# EAGLE design ISP_LPC9xx_USB_RE_v1.1_mini (EAGLE 5.11)
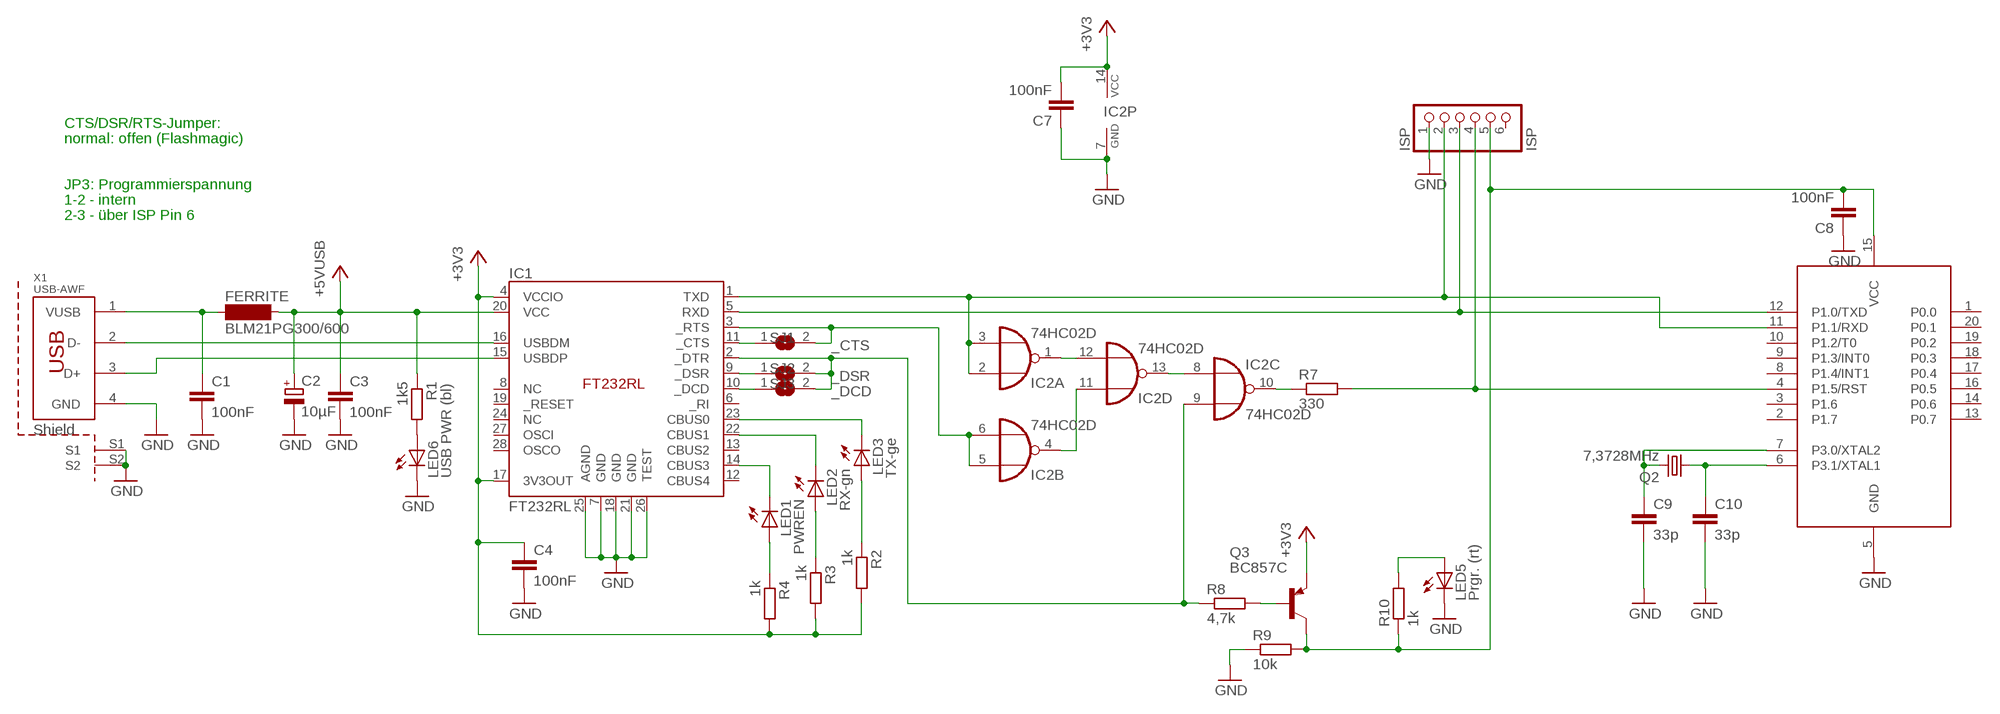
[diagram p0: schematic, sheet 1]

## Parts
C1  100nF  C-EUC0805K  [C0805K]
C2  10µF  CPOL-EU153CLV-0405  [153CLV-0405]
C3  100nF  C-EUC0805K  [C0805K]
C4  100nF  C-EUC0805K  [C0805K]
C7  100nF  C-EUC0805K  [C0805K]
C8  100nF  C-EUC0805K  [C0805K]
C9  33p  C-EUC0805K  [C0805K]
C10  33p  C-EUC0805K  [C0805K]
FERRITE  BLM21PG300/600  SM-1206  [SM-1206]
IC1  FT232RL  [SSOP-28]
IC2  74HC02D  [SO14]
ISP  ISP  PINHD-1X6  [1X06]
LED1  PWREN  LEDCHIP-LED0805  [CHIP-LED0805]
LED2  RX-gn  LEDCHIP-LED0805  [CHIP-LED0805]
LED3  TX-ge  LEDCHIP-LED0805  [CHIP-LED0805]
LED5  Prgr. (rt)  LEDCHIP-LED0805  [CHIP-LED0805]
LED6  USB PWR (bl)  LEDCHIP-LED0805  [CHIP-LED0805]
Q2  7,3728MHz  CRYSTALHC49S  [HC49/S]
Q3  BC857C  BC857C-PNP-SOT23-BEC  [SOT23-BEC]
R1  1k5  R-EU_M1206  [M1206]
R2  1k  R-EU_M1206  [M1206]
R3  1k  R-EU_M1206  [M1206]
R4  1k  R-EU_M1206  [M1206]
R7  330  R-EU_M1206  [M1206]
R8  4,7k  R-EU_M1206  [M1206]
R9  10k  R-EU_M1206  [M1206]
R10  1k  R-EU_M1206  [M1206]
SJ1  _CTS  SJ  [SJ]
SJ2  _DSR  SJ  [SJ]
SJ3  _DCD  SJ  [SJ]
U2  89LPC922  [DIL20]
X1  USB-AWF  USB-1X-2S-PLUG-A-THT  [USB-PLUG-A-THT-2S]

## Nets
+3V3: C4.1 C7.2 IC1.4(VCCIO) IC1.17(3V3OUT) IC2.14(P:VCC) Q3.E R2.2 R3.2 R4.2
+5V: C2.+ C3.1 FERRITE.2 IC1.20(VCC) R1.1 ; supply symbol labelled +5VUSB
DSR_DCD_DTR: IC1.2(_DTR) IC2.9(C:I1) R8.1 SJ2.2 SJ3.2
GND: C1.2 C2.- C3.2 C4.2 C7.1 C8.1 C9.2 C10.2 IC1.7(GND) IC1.18(GND) IC1.21(GND) IC1.25(AGND) IC1.26(TEST) IC2.7(P:GND) ISP.1 LED5.C LED6.C R9.1 U2.5(GND) X1.4(GND) X1.S1 X1.S2
N$1: IC1.5(RXD) ISP.3 U2.12(P1.0/TXD)
N$2: C9.1 Q2.2 U2.7(P3.0/XTAL2)
N$3: IC2.4(B:O) IC2.11(D:I0)
N$5: ISP.4 R7.2 U2.4(P1.5/RST)
N$6: C8.2 ISP.5 Q3.C R9.2 R10.1 U2.15(VCC)
N$8: IC1.1(TXD) IC2.2(A:I0) IC2.3(A:I1) ISP.2 U2.11(P1.1/RXD)
N$9: LED6.A R1.2
N$10: IC2.1(A:O) IC2.12(D:I1)
N$11: C10.1 Q2.1 U2.6(P3.1/XTAL1)
N$13: LED5.A R10.2
N$14: IC1.16(USBDM) X1.2(D-)
N$15: IC2.8(C:I0) IC2.13(D:O)
N$17: IC1.15(USBDP) X1.3(D+)
N$19: Q3.B R8.2
N$20: IC1.11(_CTS) SJ1.1
N$21: IC1.9(_DSR) SJ2.1
N$22: IC1.10(_DCD) SJ3.1
N$23: LED2.A R3.1
N$24: LED3.A R2.1
N$25: IC1.22(CBUS1) LED2.C
N$26: IC1.23(CBUS0) LED3.C
N$28: IC2.10(C:O) R7.1
N$29: IC1.14(CBUS3) LED1.C
N$30: LED1.A R4.1
N$47: C1.1 FERRITE.1 X1.1(VUSB)
RTS_CTS1: IC1.3(_RTS) IC2.5(B:I0) IC2.6(B:I1) SJ1.2
Unconnected: IC1.6(_RI) IC1.8(NC) IC1.12(CBUS4) IC1.13(CBUS2) IC1.19(_RESET) IC1.24(NC) IC1.27(OSCI) IC1.28(OSCO) ISP.6 U2.1(P0.0) U2.2(P1.7) U2.3(P1.6) U2.8(P1.4/INT1) U2.9(P1.3/INT0) U2.10(P1.2/T0) U2.13(P0.7) U2.14(P0.6) U2.16(P0.5) U2.17(P0.4) U2.18(P0.3) U2.19(P0.2) U2.20(P0.1)

## Notes on the sheet
- CTS/DSR/RTS-Jumper:
- normal: offen (Flashmagic)
- JP3: Programmierspannung
- 1-2 - intern
- 2-3 - über ISP Pin 6

## Library data of the parts
C1 C3 C4 C7-C10 = rcl:C-EU: CAPACITOR, European symbol
C2 = rcl:CPOL-EU: POLARIZED CAPACITOR, European symbol
FERRITE = inductor-neosid:SM-1206: INDUCTOR SMD chip inductor
IC1 = ftdi4:FT232RL
IC2 = 74xx-eu:74*02: Quad 2-input NOR gate
ISP = pinhead:PINHD-1X6: PIN HEADER
LED1-LED3 LED5 LED6 = led:LED: LED OSRAM: - CHIPLED LG R971, LG N971, LY N971, LG Q971, LY Q971, LO R971, LY R971 LH N974, LH R974 LS Q976, LO Q976, LY Q976 LO Q996 - Hyper CHIPLED LW Q18S LB Q993, LB Q99A, LB R99A - SideLED LS A670, LO A670, LY A670, LG A670, LP A670 LB A673, LV A673, LT A673, LW A673 LH A674 LY A675 LS A676, LA A676, LO A676, LY A676, LW A676 LS A679, LY A679, LG A679 - Hyper Micro SIDELED® LS Y876, LA Y876, LO Y876, LY Y876 LT Y87S - SmartLED LW L88C, LW L88S LB L89C, LB L89S, LG L890 LS L89K, LO L89K, LY L89K LS L896, LA L896, LO L896, LY L896 - TOPLED LS T670, LO T670, LY T670, LG T670, LP T670 LSG T670, LSP T670, LSY T670, LOP T670, LYG T670 LG T671, LOG T671, LSG T671 LB T673, LV T673, LT T673, LW T673 LH T674 LS T676, LA T676, LO T676, LY T676, LB T676, LH T676, LSB T676, LW T676 LB T67C, LV T67C, LT T67C, LS T67K, LO T67K, LY T67K, LW E67C LS E67B, LA E67B, LO E67B, LY E67B, LB E67C, LV E67C, LT E67C LW T67C LS T679, LY T679, LG T679 LS T770, LO T770, LY T770, LG T770, LP T770 LB T773, LV T773, LT T773, LW T773 LH T774 LS E675, LA E675, LY E675, LS T675 LS T776, LA T776, LO T776, LY T776, LB T776 LHGB T686 LT T68C, LB T68C - Hyper Mini TOPLED® LB M676 - Mini TOPLED Santana® LG M470 LS M47K, LO M47K, LY M47K Source: http://www.osram.convergy.de LUXEON: - LUMILED® LXK2-PW12-R00, LXK2-PW12-S00, LXK2-PW14-U00, LXK2-PW14-V00 LXK2-PM12-R00, LXK2-PM12-S00, LXK2-PM14-U00 LXK2-PE12-Q00, LXK2-PE12-R00, LXK2-PE12-S00, LXK2-PE14-T00, LXK2-PE14-U00 LXK2-PB12-K00, LXK2-PB12-L00, LXK2-PB12-M00, LXK2-PB14-N00, LXK2-PB14-P00, LXK2-PB14-Q00 LXK2-PR12-L00, LXK2-PR12-M00, LXK2-PR14-Q00, LXK2-PR14-R00 LXK2-PD12-Q00, LXK2-PD12-R00, LXK2-PD12-S00 LXK2-PH12-R00, LXK2-PH12-S00 LXK2-PL12-P00, LXK2-PL12-Q00, LXK2-PL12-R00 Source: www.luxeon.com KINGBRIGHT: KA-3528ASYC Source: www.kingbright.com
Q2 = crystal:CRYSTAL: CRYSTAL
Q3 = transistor:*-PNP-: PNP Transistror
R1-R4 R7-R10 = resistor:R-EU_: RESISTOR, European symbol
SJ1-SJ3 = jumper:SJ: SMD solder JUMPER
U2 = micro-philips:89LPC922
X1 = _con-usb_1:USB-1X-2S: USB A/M USB Typ A / USB Typ B Ausführung SMD/THT/DIP, Side-Entry, Ultraflach 2x Shield Reichelt USB-AGF, USB-AWF

## Board
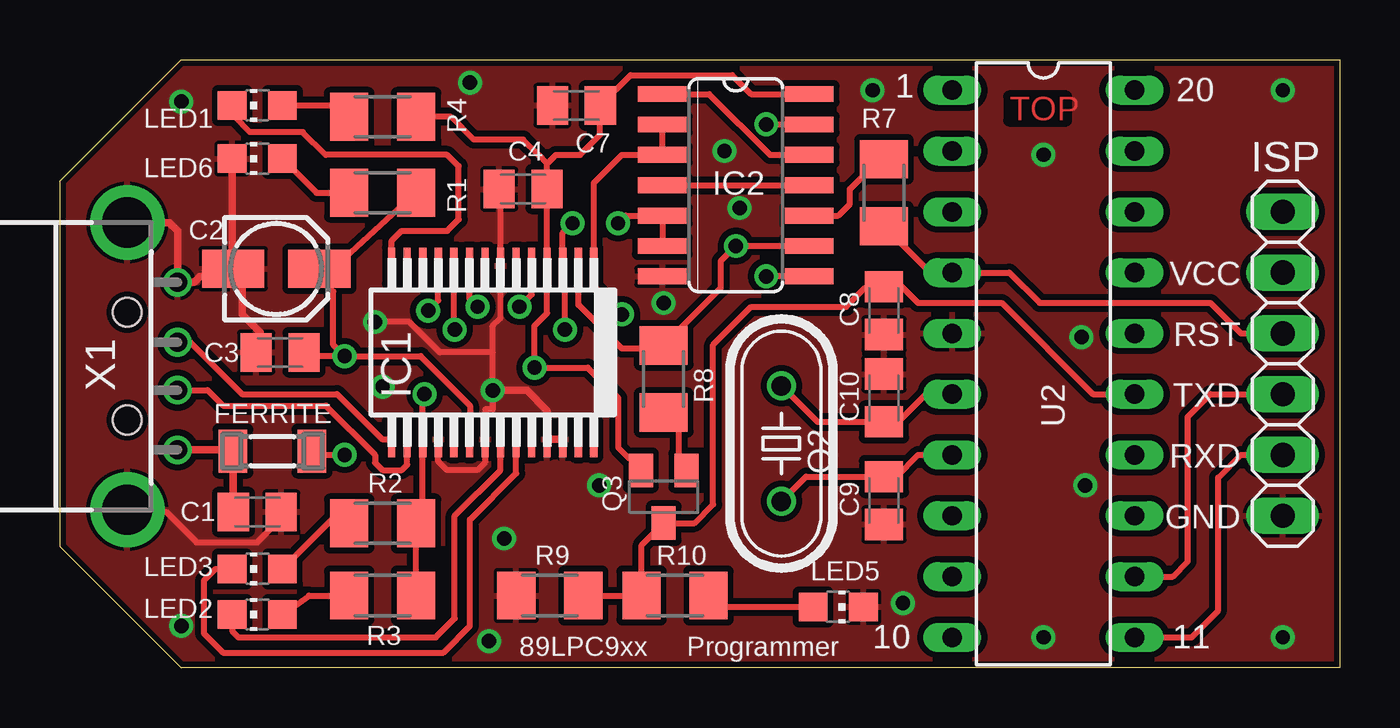
[diagram p1: board, top side]
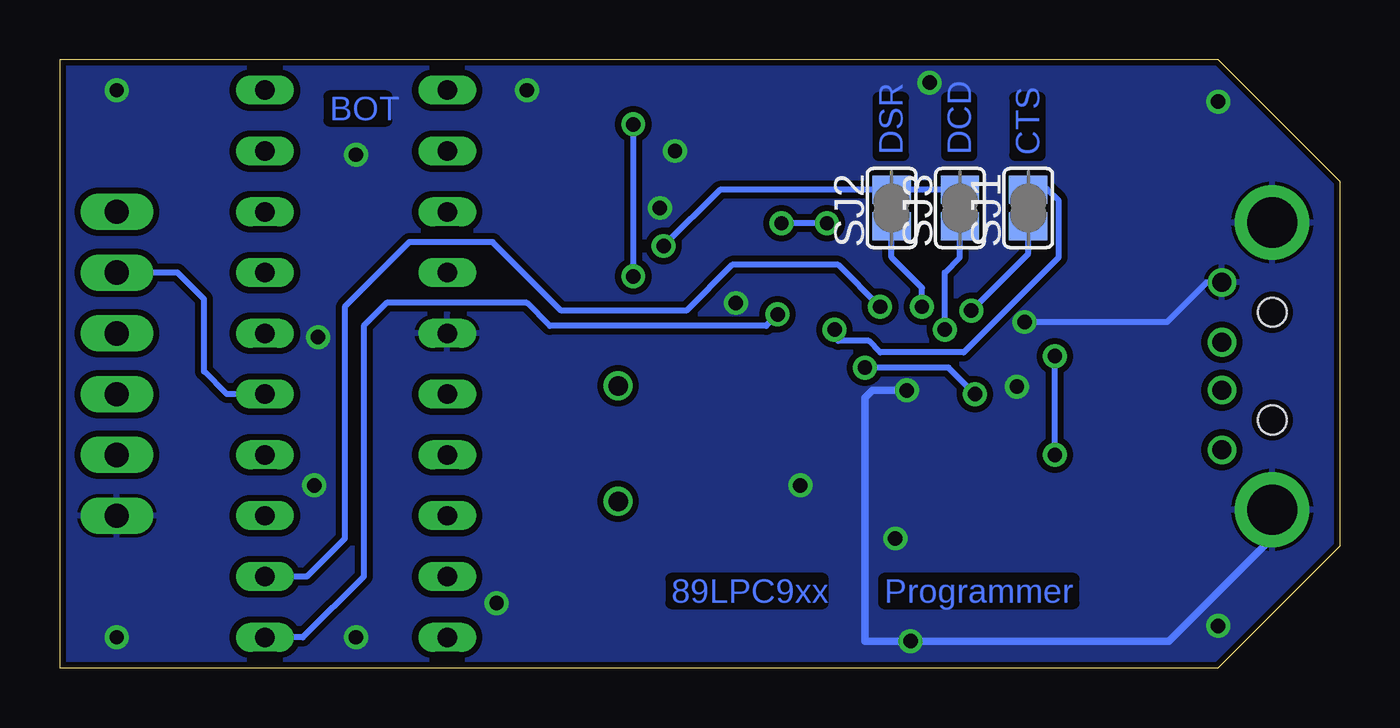
[diagram p2: board, bottom side, seen from below]

Size 53.5 x 25.4 mm. Coordinates in mm from the lower left corner, seen from the top.
Outline: 0,20.32 0,5.08 5.08,0 53.5,0 53.5,25.4 5.08,25.4 0,20.32
Copper layers (1*16): Top 0.035mm / dielectric 1.5mm / Bottom 0.035mm
Design rules "2layer_20110523": minimum track width 0.15mm, minimum drill 0.3mm, track to track 0.15mm, track to pad 0.15mm, pad to pad 0.15mm, via to via 0.15mm, smd to smd 0.15mm, copper to edge 0.15mm, drill to drill 0.2mm, minimum pad ring 0.15mm, minimum via ring 0.2mm, stop-mask expansion 0.15mm, vias tented up to drill 0.8mm, thermal gap 0.15mm

### Footprints (pad centres in the part's own frame; a part is rotated, then mirrored left to right if it is on the bottom)
C0805K = smd 1.3 x 1.6: 1 -1,0; 2 1,0
153CLV-0405 = smd 2.6 x 1.6: + 1.8,0; - -1.8,0
SM-1206 = smd 1.2 x 1.8: 1 -1.65,0; 2 1.65,0
SSOP-28 = smd 0.3 x 1.5: 1 -4.225,-3.625; 2 -3.575,-3.625; 3 -2.925,-3.625; 4 -2.275,-3.625; 5 -1.625,-3.625; 6 -0.975,-3.625; 7 -0.325,-3.625; 8 0.325,-3.625; 9 0.975,-3.625; 10 1.625,-3.625; 11 2.275,-3.625; 12 2.925,-3.625; 13 3.575,-3.625; 14 4.225,-3.625; 15 4.225,3.625; 16 3.575,3.625; 17 2.925,3.625; 18 2.275,3.625; 19 1.625,3.625; 20 0.975,3.625; 21 0.325,3.625; 22 -0.325,3.625; 23 -0.975,3.625; 24 -1.625,3.625; 25 -2.275,3.625; 26 -2.925,3.625; 27 -3.575,3.625; 28 -4.225,3.625
SO14 = smd 0.66 x 2.032: 1 -3.81,-3.073; 2 -2.54,-3.073; 3 -1.27,-3.073; 4 0,-3.073; 5 1.27,-3.073; 6 2.54,-3.073; 7 3.81,-3.073; 8 3.81,3.073; 9 2.54,3.073; 10 1.27,3.073; 11 0,3.073; 12 -1.27,3.073; 13 -2.54,3.073; 14 -3.81,3.073
1X06 = drill 1.016 long: 1 -6.35,0; 2 -3.81,0; 3 -1.27,0; 4 1.27,0; 5 3.81,0; 6 6.35,0
CHIP-LED0805 = smd 1.2 x 1.2: A 0,-1.05; C 0,1.05
HC49/S = drill 0.813 round: 1 -2.413,0; 2 2.413,0
SOT23-BEC = smd 1 x 1.4: B -0.95,-1.1; C 0,1.1; E 0.95,-1.1
M1206 = smd 1.6 x 2: 1 -1.4,0; 2 1.4,0
SJ = smd 1.168 x 1.6: 1 -0.762,0; 2 0.762,0
DIL20 = drill 0.813 long: 1 -11.43,-3.81; 2 -8.89,-3.81; 3 -6.35,-3.81; 4 -3.81,-3.81; 5 -1.27,-3.81; 6 1.27,-3.81; 7 3.81,-3.81; 8 6.35,-3.81; 9 8.89,-3.81; 10 11.43,-3.81; 11 11.43,3.81; 12 8.89,3.81; 13 6.35,3.81; 14 3.81,3.81; 15 1.27,3.81; 16 -1.27,3.81; 17 -3.81,3.81; 18 -6.35,3.81; 19 -8.89,3.81; 20 -11.43,3.81
USB-PLUG-A-THT-2S = drill 0.8 round: 1 10,-3.6; 2 10,-1.1; 3 10,0.9; 4 10,3.4 | drill 2.1 round: S1 7.9,-6.1; S2 7.9,5.9 | hole 1.2: 7.9,-2.35; 7.9,2.15

### Placement (x,y rotation side)
C1  8.26,6.51 0 top
C2  9.05,16.67 0 top
C3  9.21,13.18 180 top
C4  19.37,20 180 top
C7  21.59,23.49 0 top
C8  34.45,14.92 90 top
C9  34.45,6.99 270 top
C10  34.45,11.27 90 top
FERRITE  8.89,9.05 0 top
IC1  18.1,13.18 180 top
IC2  28.26,20.16 270 top
ISP  51.12,12.7 90 top
LED1  8.26,23.49 90 top
LED2  8.26,2.22 90 top
LED3  8.26,4.13 90 top
LED5  32.54,2.54 270 top
LED6  8.26,21.27 90 top
Q2  30.16,9.37 270 top
Q3  25.24,7.14 180 top
R1  13.49,19.84 180 top
R2  13.49,6.03 0 top
R3  13.49,3.02 0 top
R4  13.49,23.02 0 top
R7  34.45,19.84 270 top
R8  25.24,12.07 270 top
R9  20.48,3.02 0 top
R10  25.72,3.02 0 top
SJ1  13.02,19.21 90 bottom
SJ2  18.73,19.21 90 bottom
SJ3  15.88,19.21 90 bottom
U2  41.12,12.7 270 top
X1  -5.08,12.7 0 top

### Tracks (layer width: path | path; a pad name or v marks a point on that pad's centre or on a via)
+3V3  (via drill 0.6)
  Top 0.254: R3.2 R2.2 | R2.2 14.61,6.06 | R2.2 15.17,6.03 IC1.17 15.17,11.36 v15.24,11.43 | Q3.E 23.34,9.2 23.34,11.27 22.07,12.54 v19.84,12.54 19.84,14.29 20.37,14.82 IC1.4 C4.1 20.37,21.07 | 20.37,21.07 20,21.43 19.37,22.07 17.3,22.07 16.35,23.02 R4.2 | IC2.14 28.89,23.97 28.1,24.77 23.86,24.77 C7.2 22.59,22.27 21.75,21.43 20.73,21.43 20.37,21.07
  Bottom 0.254: v15.24,11.43 16.35,12.54 v19.84,12.54
+5V  (via drill 0.6)
  Top 0.254: R1.1 11.17,16.43 C2.+ 11.17,15.98 11.43,15.72 11.43,13.49 v11.91,13.02 | C3.1 10.37,13.02 v11.91,13.02 | IC1.20 17.14,9.57 17.14,10.95 15.08,13.02 v11.91,13.02 | FERRITE.2 10.79,9.05 10.95,8.89 v11.91,8.89
  Bottom 0.254: v11.91,8.89 12.07,8.73 | 12.07,8.73 | 12.07,8.73 v11.91,8.89 | v11.91,8.89 v11.91,13.02
DSR_DCD_DTR  (via drill 0.6)
  Top 0.254: IC1.2 21.67,15.16 23.5,13.34 25.05,13.34 R8.1 27.62,15.85 27.62,16.99 v28.26,17.62 IC2.9
  Bottom 0.254: SJ3.2 SJ2.2 25.91,19.97 v28.26,17.62
GND  (via drill 0.6)
  Top 0.254: IC1.7 | 18.1,13.18 v18.1,11.59 18.1,10.8 17.78,10.8 17.78,10.32 17.77,10.31 IC1.21 17.77,8.56 17.46,8.25 16.19,8.25 15.82,8.62 IC1.18 | 18.1,13.18 18.1,14.29 18.41,14.6 IC1.7 | C1.2 9.26,6.24 8.26,5.24 5.71,5.24 4.45,6.51 2.91,6.51 X1.S1 | IC1.7 18.41,20 C4.2 | v13.18,14.45 14.61,14.45 15.88,13.18 18.1,13.18
  Top 0.305: C2.- 7.42,16.2 | C2.- 7.21,16.71 LED6.C | C3.2 8.37,14.02 7.62,14.76 7.62,16.3 C2.- | IC1.26 IC1.25 20.37,10.74 19.53,11.59 v18.1,11.59 | C2.- 7.57,16.35 5.87,16.35 5.62,16.1 X1.4 4.92,18.26 4.58,18.6 X1.S2
  Bottom 0.254: v13.18,14.45 7.21,14.45 5.56,16.1 X1.4
  Bottom 0.305: v18.1,11.59 19.53,11.59 19.84,11.27 19.84,1.11 v17.94,1.11 7.14,1.11 2.86,5.4 2.82,5.43 X1.S1
  other vias: 17.14,24.45 5.08,23.65 5.08,1.75 51.12,24.13 51.12,1.27 18.57,5.4 13.49,11.75 25.24,15.24 28.42,19.21 27.78,21.59 33.97,24.13 42.86,7.62 41.12,1.27 41.12,21.43 42.7,13.81 35.24,2.7 22.54,7.62
  pour Bottom (isolate 0.254): 0,20.32 5.08,25.4 53.5,25.4 53.5,0 5.08,0 0,5.08
  pour Top (isolate 0.254): 0,20.32 5.08,25.4 53.5,25.4 53.5,0 5.08,0 0,5.08
N$1  (via drill 0.6)
  Top 0.254: ISP.3 48.1,11.43 47.15,10.48 47.15,4.45 46.51,3.81 U2.12 | IC1.5 19.72,15.59 v19.21,15.08
  Bottom 0.254: U2.12 43.18,3.81 41.59,5.4 41.59,15.08 38.89,17.78 35.4,17.78 32.54,14.92 27.3,14.92 25.4,16.83 20.96,16.83 v19.21,15.08
N$2
  Top 0.254: U2.7 35.88,8.89 34.97,7.98 C9.1 31.2,7.98 Q2.2
N$3
  Top 0.254: IC2.4 IC2.11
N$5
  Top 0.254: R7.2 36.38,16.51 U2.4 39.69,16.51 40.96,15.24 48.1,15.24 49.37,13.97 ISP.4
N$6
  Top 0.254: R9.2 | R9.2 R10.1 24.32,5.12 Q3.C 26.52,6.04 27.3,6.83 27.3,13.49 28.89,15.08 32.86,15.08 33.65,15.88 34.4,15.88 C8.2 35.2,15.92 35.88,15.24 39.37,15.24 43.18,11.43 U2.15
  Bottom 0.254: U2.15 46.51,11.43 47.47,12.38 47.47,15.4 48.58,16.51 ISP.5
N$8  (via drill 0.6)
  Top 0.254: ISP.2 49.37,8.89 48.42,7.94 48.42,2.38 47.31,1.27 U2.11 | IC2.2 IC2.3 23.5,21.43 22.32,20.26 IC1.1 22.32,15.94 v23.5,14.76
  Bottom 0.254: U2.11 43.34,1.27 40.8,3.81 40.8,14.29 39.85,15.24 33.97,15.24 33.02,14.29 23.97,14.29 v23.5,14.76
N$9
  Top 0.254: LED6.A 10.73,19.84 R1.2
N$10
  Top 0.254: IC2.12 29.69,21.43 27.15,23.97 25.34,23.97 IC2.1
N$11
  Top 0.254: U2.6 36.2,11.43 34.88,10.11 C10.1 31.67,10.27 Q2.1
N$13
  Top 0.254: R10.2 27.59,2.54 LED5.A
N$14
  Top 0.254: IC1.16 14.52,8.49 14.29,8.25 13.49,8.25 13.18,8.57 13.18,8.89 11.11,10.95 6.83,10.95 6.18,11.6 X1.2
N$15  (via drill 0.6)
  Top 0.254: IC2.13 29.84,22.7 v29.53,22.7 | v29.53,16.35 31.49,16.35 IC2.8
  Bottom 0.254: v29.53,16.35 v29.53,22.7
N$17
  Top 0.254: IC1.15 13.47,9.55 11.59,11.43 7.62,11.43 5.45,13.6 X1.3
N$19
  Top 0.254: Q3.B 25.88,8.56 25.88,10.32 25.53,10.66 R8.2
N$20  (via drill 0.6)
  Top 0.254: IC1.11 15.82,15.35 v15.4,14.92
  Bottom 0.254: v15.4,14.92 13.02,17.3 SJ1.1
N$21  (via drill 0.6)
  Top 0.254: IC1.9 17.12,15.42 v17.46,15.08
  Bottom 0.254: v17.46,15.08 17.46,15.88 18.73,17.14 SJ2.1 | SJ2.1
N$22  (via drill 0.6)
  Top 0.254: IC1.10 16.47,14.25 v16.51,14.13
  Bottom 0.254: v16.51,14.13 16.51,16.51 15.88,17.14 SJ3.1 | SJ3.1
N$23
  Top 0.254: R3.1 10.42,3.02 LED2.A
N$24
  Top 0.254: R2.1 11.53,6.35 LED3.A
N$25
  Top 0.254: LED2.C 7.21,1.53 7.46,1.27 15.72,1.27 16.51,2.06 16.51,6.35 18.41,8.25 IC1.22
N$26
  Top 0.254: LED3.C 6.51,4.13 6.03,3.65 6.03,1.43 6.83,0.63 16.03,0.63 17.14,1.75 17.14,6.19 19.07,8.12 IC1.23
N$28
  Top 0.254: R7.1 34.26,21.24 33.02,20 33.02,19.37 32.54,18.89 31.49,18.89 IC2.10
N$29
  Top 0.254: LED1.C 7.3,23.4 7.3,23.02 7.94,22.38 10.16,22.38 11.11,21.43 16.19,21.43 16.67,20.95 16.67,18.73 16.19,18.26 14.29,18.26 13.87,17.84 IC1.14
N$30
  Top 0.254: LED1.A 11.3,23.49 arc-90 R4.1
N$47
  Top 0.254: FERRITE.1 arc90 7.09,9.2 6.99,9.1 | 7.24,6.52 arc90 C1.1
  Top 0.305: FERRITE.1 7.24,6.52 | X1.1 6.99,9.1
RTS_CTS1  (via drill 0.6)
  Top 0.254: IC2.6 IC2.5 23.65,18.89 v23.34,18.57 | v21.11,14.13 21.11,15.72 21.02,15.81 IC1.3 21.02,18.16 v21.43,18.57
  Bottom 0.254: SJ1.2 12.99,20 12.22,20 11.75,19.53 11.75,17.14 15.72,13.18 19.21,13.18 19.68,13.65 20.96,13.65 21.11,13.81 v21.11,14.13 | v23.34,18.57 21.91,18.57 v21.43,18.57

### Text on the board
Top: TOP
Bottom: BOT | CTS | DCD | DSR | Programmer | 89LPC9xx
tNames: 1 | 20 | VCC | RST | TXD | RXD | GND | 89LPC9xx | Programmer | 10 | 11